# EAGLE design Grove - UV Sensor v1.0 (EAGLE 6.3)
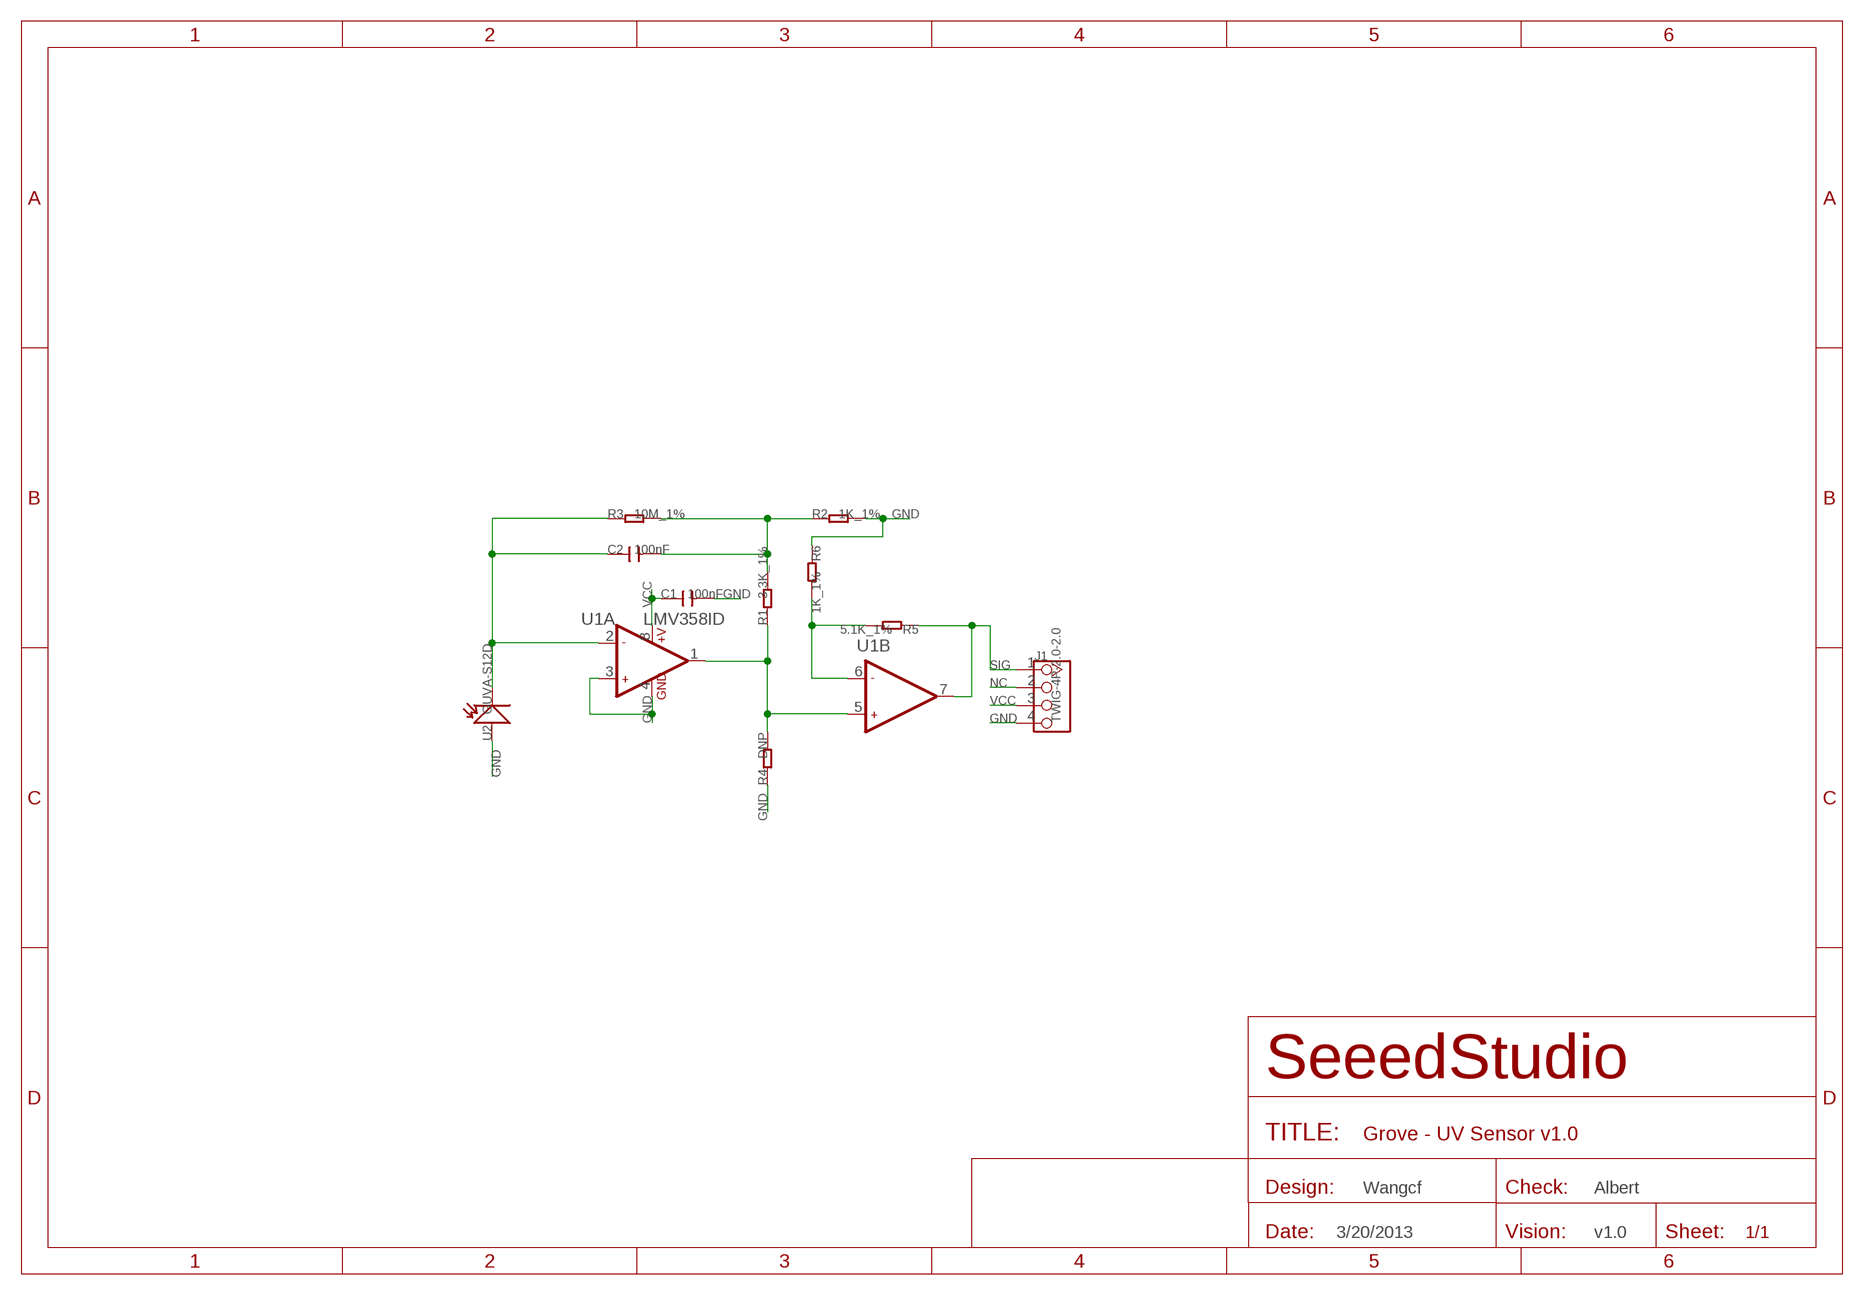
[diagram p0: schematic, sheet 1]

## Parts
C1  100nF  C-0603  [C0603]
C2  100nF  C-0603  [C0603]
J1  TWIG-4P-2.0-2.0  [4P-2.0]
R1  3.3K_1%  R-0603  [R0603]
R2  1K_1%  R-0603  [R0603]
R3  10M_1%  R-0603  [R0603]
R4  DNP  R-0603  [R0603]
R5  5.1K_1%  R-0603  [R0603]
R6  1K_1%  R-0603  [R0603]
U1  LMV358ID  LMV358D  [SO08]
U2  GUVA-S12D  PHOTODIODE  [LED-3528]

## Nets
GND: C1.2 J1.4 R2.2 R4.1 R6.1 U1.3(A:+IN1) U1.4(A:GND) U2.1(+)
N$1: C2.1 R3.1 U1.2(A:-IN1) U2.2(-)
N$2: R5.2 R6.2 U1.6(B:-IN2)
N$3: C2.2 R1.2 R2.1 R3.2
N$4: J1.1 R5.1 U1.7(B:OUT2)
NC: J1.2
SIG: R1.1 R4.2 U1.1(A:OUT1) U1.5(B:+IN2)
VCC: C1.1 J1.3 U1.8(A:+V)

## Notes on the sheet
- Wangcf | Albert
- 3/20/2013 | v1.0

## Library data of the parts
C1 C2 = Discrete:C*: Ceramic Capacitors
J1 = Connector:TWIG-4P-2.0
R1-R6 = Discrete:R*
U1 = IC:LMV358: General purpose LOW Voltage, Rail-to-Rail Output Amplifiers http://www.fairchildsemi.com/ds/LM/LMV358.pdf
U2 = Test:PHOTODIODE

## Board
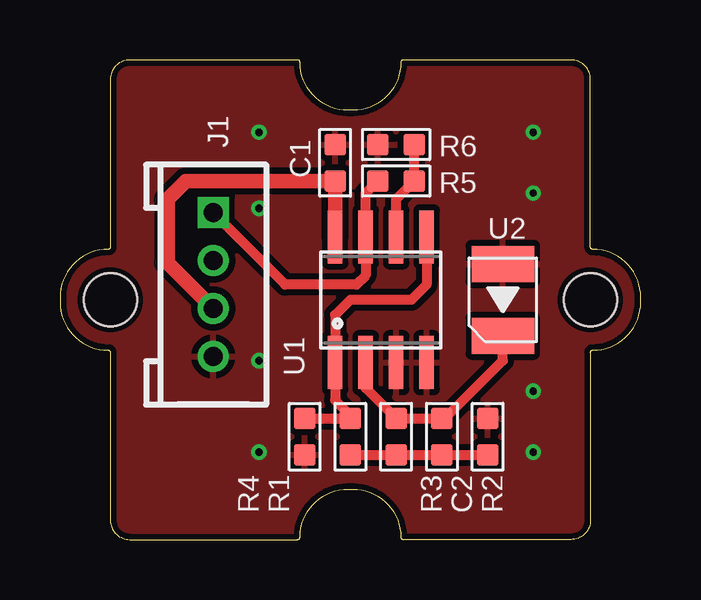
[diagram p1: board, top side]
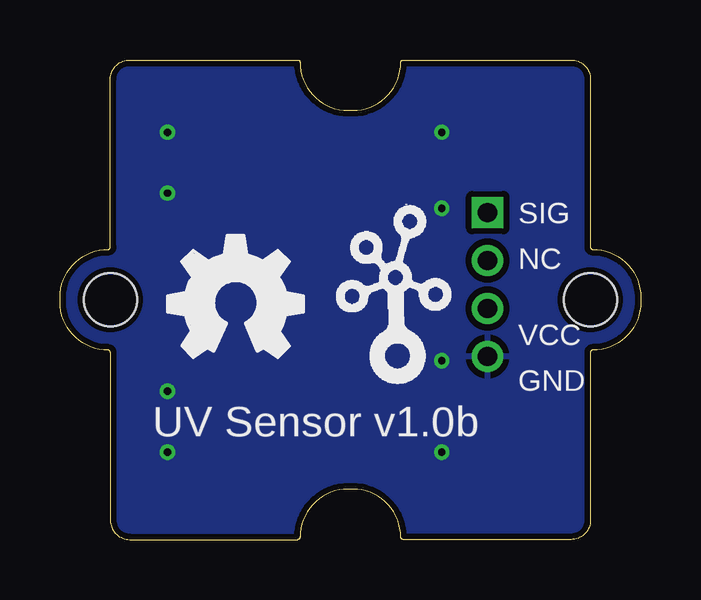
[diagram p2: board, bottom side, seen from below]

Size 24.2 x 20 mm. Coordinates in mm from the lower left corner, seen from the top.
Copper layers (1*16): Top 0.035mm / dielectric 1.5mm / Bottom 0.035mm
Design rules "SeeedStudio_rule_no_angle_090911 *": minimum track width 6mil, minimum drill 12mil, track to track 6mil, track to pad 6mil, pad to pad 6mil, via to via 6mil, smd to smd 0mil, copper to edge 10mil, drill to drill 10mil, minimum pad ring 10mil, minimum via ring 6mil, stop-mask expansion 2mil, vias tented up to drill 25mil, thermal gap 10mil

### Footprints (pad centres in the part's own frame; a part is rotated, then mirrored left to right if it is on the bottom)
C0603 = smd 0.889 x 0.889: 1 -0.762,0; 2 0.762,0
4P-2.0 = drill 0.8 pad 1.27 square: 1 -3,0 | drill 0.8 pad 1.27: 2 -1,0; 3 1,0; 4 3,0
R0603 = smd 0.889 x 0.889: 1 -0.762,0; 2 0.762,0
SO08 = smd 0.61 x 2.21: 1 -1.905,-2.616; 2 -0.635,-2.616; 3 0.635,-2.616; 4 1.905,-2.616; 5 1.905,2.616; 6 0.635,2.616; 7 -0.635,2.616; 8 -1.905,2.616
LED-3528 = smd 1.5 x 2.6: 1 -1.5,0; 2 1.5,0
1U-DIM-W/-DRILL = hole 2.2: 0,-10; 0,10

### Placement (x,y rotation side)
C1  11.46,15.71 90 top
C2  15.91,4.29 270 top
J1  6.38,10.63 270 top
R1  12.1,4.29 270 top
R2  17.81,4.29 90 top
R3  14,4.29 270 top
R4  10.2,4.29 90 top
R5  14,14.95 0 top
R6  14,16.48 0 top
U1  13.37,10 0 top
U2  18.45,10 270 top
U$1  [1U-DIM-W/-DRILL]  12.1,10 270 top
U$3  [OSHW_FILLX200_NOTEXT]  19.72,7.59 0 bottom
U$4  [TWIGLOGO]  10.2,7.46 0 bottom

### Tracks (layer width: path | path; a pad name or v marks a point on that pad's centre or on a via)
GND  (via drill 0.3 pad 0.64)
  other vias: 8.29,13.81 8.29,7.46 8.29,16.98 8.29,3.65 19.72,16.98 19.72,14.45 19.72,3.65 19.72,6.19
  pour Top (isolate 0.254): -0.6,-1.3 -0.6,22.32 24.8,22.32 24.8,-1.3
  pour Bottom (isolate 0.254): -0.6,-1.3 24.8,-1.3 24.8,22.32 -0.6,22.32
N$1
  Top 0.406: U1.2 12.73,6.32 R3.1 C2.1 16.04,5.05 18.45,7.46 U2.2 18.45,8.6
N$2
  Top 0.406: U1.6 14,14.19 R5.2 R6.2
N$3
  Top 0.406: R3.2 R1.2 C2.2 R2.1
N$4
  Top 0.406: R5.1 12.73,14.45 U1.7 12.73,11.02 12.35,10.63 9.38,10.63 J1.1
SIG
  Top 0.406: 12.1,5.17 11.46,5.81 U1.1 11.46,9.37 12.1,10 14.64,10 15.27,10.63 U1.5 | 12.1,5.17 12.23,5.05 | R4.2 11.97,5.05 | 11.97,5.05 12.1,5.17 | 11.97,5.05 R1.1
VCC
  Top 0.61: C1.1 5.24,14.95 4.48,14.19 4.48,11.54 J1.3 | U1.8 C1.1 | 11.46,15.08 C1.1

### Text on the board
bPlace: SIG | NC | VCC | GND | UV Sensor v1.0b